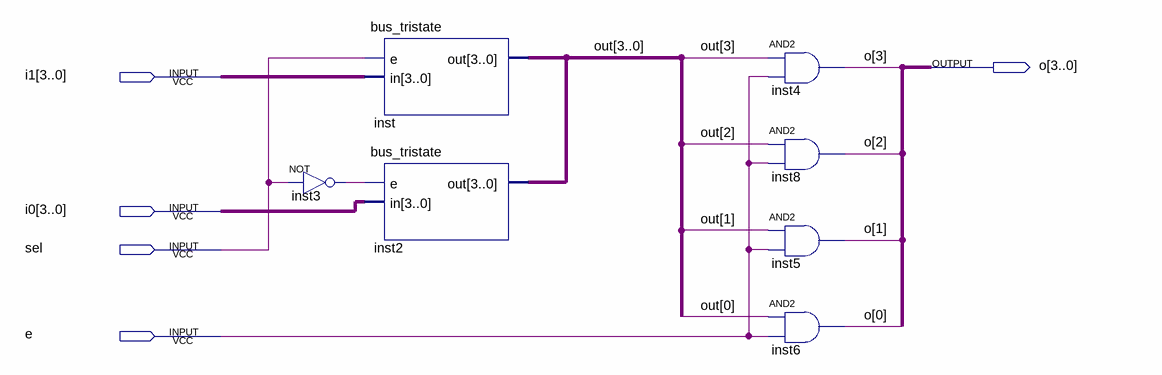
[diagram p0: schematic sheet]
// Quartus schematic mux8x4.bdf as structural Verilog: 7 symbols, 5 pins
module mux8x4 (
  input  [3:0] i1,
  input  [3:0] i0,
  input  sel,
  input  e,
  output [3:0] o
);

  wire inst3_out;
  wire [3:0] out;

  not inst3 (inst3_out, sel);
  bus_tristate inst (.e(sel), .in(i1), .out(out));
  bus_tristate inst2 (.e(inst3_out), .in(i0), .out(out));
  and inst4 (o[3], out[3], e);
  and inst8 (o[2], out[2], e);
  and inst5 (o[1], out[1], e);
  and inst6 (o[0], out[0], e);
endmodule
